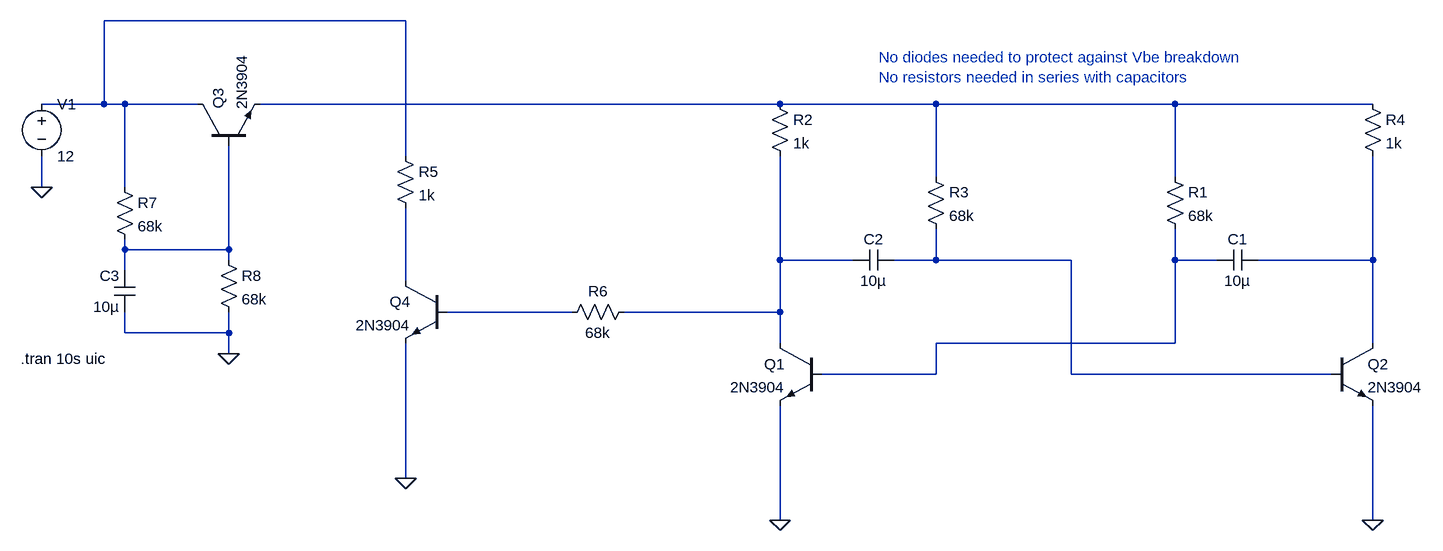
[diagram p0: schematic discrete_V2.asc]
discrete_V2.asc, the LTspice schematic file:
Version 4
SHEET 1 1544 740
WIRE -32 -64 -496 -64
WIRE -496 64 -496 -64
WIRE -496 64 -592 64
WIRE -464 64 -496 64
WIRE -352 64 -464 64
WIRE 544 64 -256 64
WIRE 784 64 544 64
WIRE 1152 64 784 64
WIRE 1456 64 1152 64
WIRE -32 144 -32 -64
WIRE 784 176 784 64
WIRE 1152 176 1152 64
WIRE -592 192 -592 144
WIRE -464 192 -464 64
WIRE -464 288 -464 272
WIRE -304 288 -304 128
WIRE -304 288 -464 288
WIRE -304 304 -304 288
WIRE 544 304 544 144
WIRE 656 304 544 304
WIRE 784 304 784 256
WIRE 784 304 720 304
WIRE 992 304 784 304
WIRE 1152 304 1152 256
WIRE 1216 304 1152 304
WIRE 1456 304 1456 144
WIRE 1456 304 1280 304
WIRE -464 320 -464 288
WIRE -32 336 -32 224
WIRE 224 384 32 384
WIRE 544 384 544 304
WIRE 544 384 304 384
WIRE -464 416 -464 384
WIRE -304 416 -304 384
WIRE -304 416 -464 416
WIRE 544 432 544 384
WIRE 1152 432 1152 304
WIRE 1152 432 784 432
WIRE 1456 432 1456 304
WIRE -304 448 -304 416
WIRE 784 480 784 432
WIRE 784 480 608 480
WIRE 992 480 992 304
WIRE 1392 480 992 480
WIRE -32 640 -32 432
WIRE 544 704 544 528
WIRE 1456 704 1456 528
FLAG -592 192 0
FLAG 544 704 0
FLAG 1456 704 0
FLAG -304 448 0
FLAG -32 640 0
SYMBOL res 1136 160 R0
SYMATTR InstName R1
SYMATTR Value 68k
SYMBOL res 528 48 R0
SYMATTR InstName R2
SYMATTR Value 1k
SYMBOL res 768 160 R0
SYMATTR InstName R3
SYMATTR Value 68k
SYMBOL res 1440 48 R0
SYMATTR InstName R4
SYMATTR Value 1k
SYMBOL voltage -592 48 R0
WINDOW 123 0 0 Left 0
WINDOW 39 0 0 Left 0
SYMATTR InstName V1
SYMATTR Value 12
SYMBOL npn 608 432 M0
SYMATTR InstName Q1
SYMATTR Value 2N3904
SYMBOL npn 1392 432 R0
SYMATTR InstName Q2
SYMATTR Value 2N3904
SYMBOL cap 720 288 R90
WINDOW 0 0 32 VBottom 2
WINDOW 3 32 32 VTop 2
SYMATTR InstName C2
SYMATTR Value 10µ
SYMBOL cap 1280 288 R90
WINDOW 0 0 32 VBottom 2
WINDOW 3 32 32 VTop 2
SYMATTR InstName C1
SYMATTR Value 10µ
SYMBOL npn -352 128 R270
SYMATTR InstName Q3
SYMATTR Value 2N3904
SYMBOL res -480 176 R0
SYMATTR InstName R7
SYMATTR Value 68k
SYMBOL res -320 288 R0
SYMATTR InstName R8
SYMATTR Value 68k
SYMBOL cap -448 384 R180
WINDOW 0 24 56 Left 2
WINDOW 3 24 8 Left 2
SYMATTR InstName C3
SYMATTR Value 10µ
SYMBOL npn 32 336 M0
SYMATTR InstName Q4
SYMATTR Value 2N3904
SYMBOL res -48 128 R0
SYMATTR InstName R5
SYMATTR Value 1k
SYMBOL res 320 368 R90
WINDOW 0 0 56 VBottom 2
WINDOW 3 32 56 VTop 2
SYMATTR InstName R6
SYMATTR Value 68k
TEXT -624 456 Left 2 !.tran 10s uic
TEXT 696 -8 Left 2 ;No diodes needed to protect against Vbe breakdown\nNo resistors needed in series with capacitors

The netlist it stands for:
* discrete_V2.asc
R1 N002 N006 68k
R2 N002 N004 1k
R3 N002 N005 68k
R4 N002 N007 1k
V1 N001 0 12
Q1 N004 N006 0 0 2N3904
Q2 N007 N005 0 0 2N3904
C2 N005 N004 10µ
C1 N007 N006 10µ
Q3 N001 N003 N002 0 2N3904
R7 N001 N003 68k
R8 N003 0 68k
C3 0 N003 10µ
Q4 N008 N009 0 0 2N3904
R5 N001 N008 1k
R6 N004 N009 68k
.model NPN NPN
.model PNP PNP
.lib standard.bjt
.tran 10s uic
* No diodes needed to protect against Vbe breakdown
* No resistors needed in series with capacitors
.backanno
.end